# Altium schematic sheet key_count.SchDoc
size A4
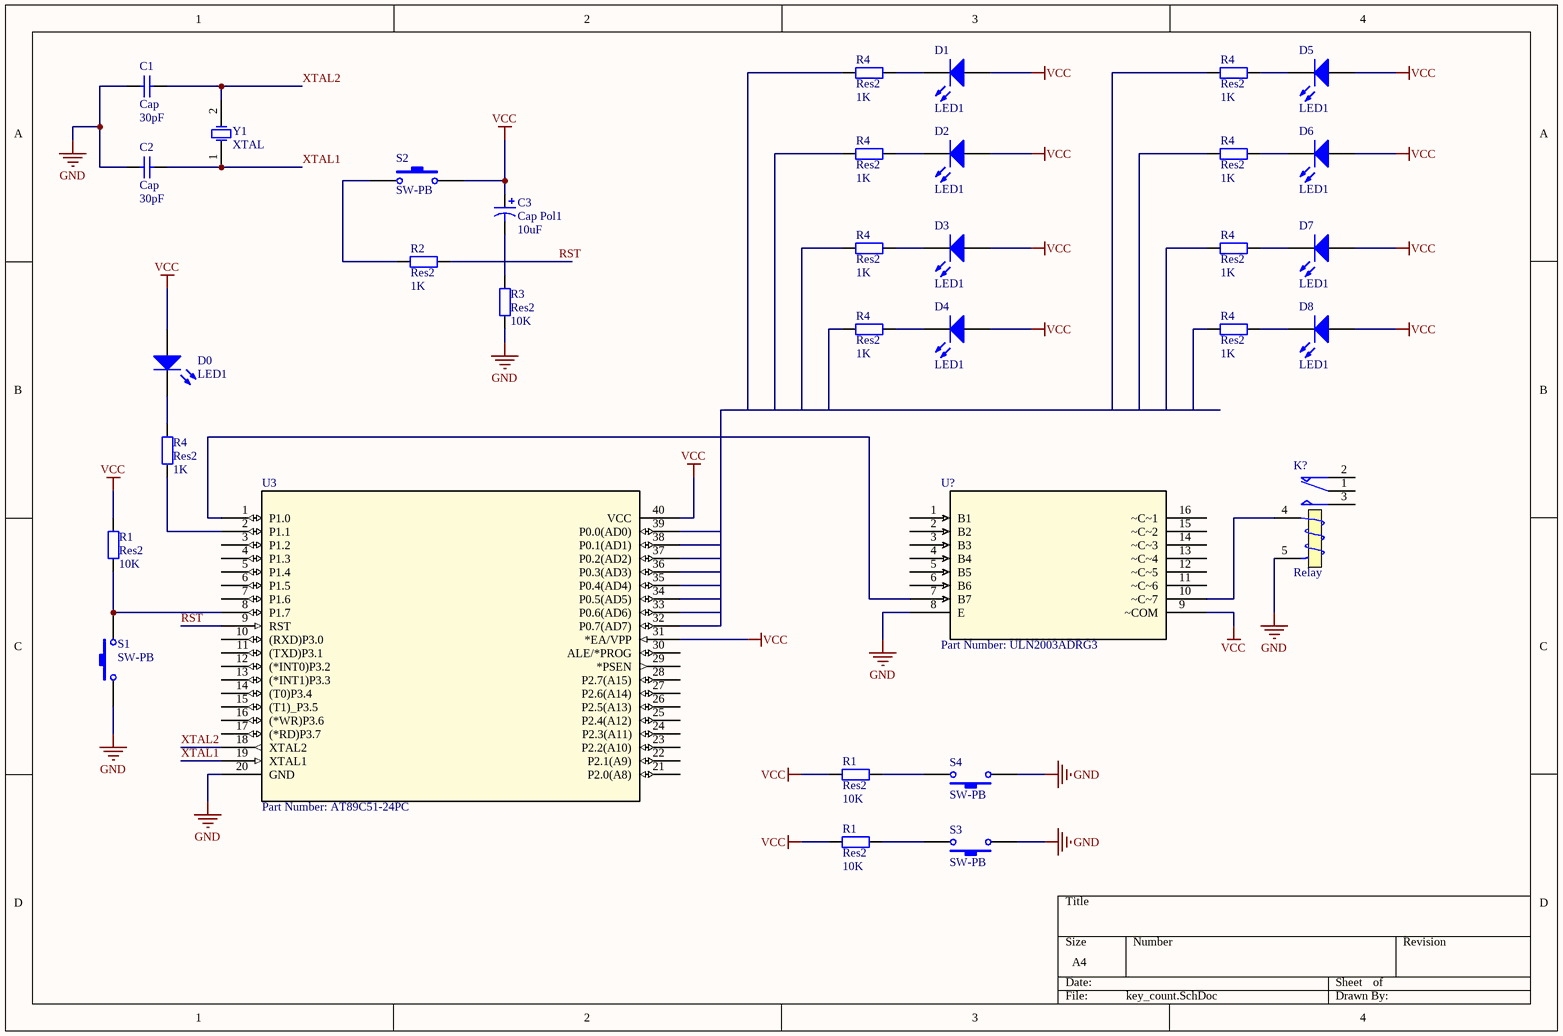
[diagram p0: key_count.SchDoc]

## Parts
(Parts that share a designator on the sheet are numbered #1, #2 ... from top to bottom, then left to right.)
C1  Cap  value 30pF  [RAD-0.3]
C2  Cap  value 30pF  [RAD-0.3]
C3  Cap Pol1  value 10uF  [RB7.6-15]
D0  LED1  [LED-1]
D1  LED1  [LED-1]
D2  LED1  [LED-1]
D3  LED1  [LED-1]
D4  LED1  [LED-1]
D5  LED1  [LED-1]
D6  LED1  [LED-1]
D7  LED1  [LED-1]
D8  LED1  [LED-1]
K?  Relay  [MODULE5B]
R1#1  Res2  value 10K  [AXIAL-0.4]
R1#2  Res2  value 10K  [AXIAL-0.4]
R1#3  Res2  value 10K  [AXIAL-0.4]
R2  Res2  value 1K  [AXIAL-0.4]
R3  Res2  value 10K  [AXIAL-0.4]
R4#1  Res2  value 1K  [AXIAL-0.4]
R4#2  Res2  value 1K  [AXIAL-0.4]
R4#3  Res2  value 1K  [AXIAL-0.4]
R4#4  Res2  value 1K  [AXIAL-0.4]
R4#5  Res2  value 1K  [AXIAL-0.4]
R4#6  Res2  value 1K  [AXIAL-0.4]
R4#7  Res2  value 1K  [AXIAL-0.4]
R4#8  Res2  value 1K  [AXIAL-0.4]
R4#9  Res2  value 1K  [AXIAL-0.4]
S1  SW-PB  [SPST-2]
S2  SW-PB  [SPST-2]
S3  SW-PB  [SPST-2]
S4  SW-PB  [SPST-2]
U3  Part Number: AT89C51-24PC  [40P6]
U?  Part Number: ULN2003ADRG3  [D16]
Y1  XTAL  [R38]

## Nets
GND: C1.1 C2.1 K?.5(T2) R3.1 S1.1 S3.1 S4.1 U3.20(GND) U?.8(E)
VCC: C3.1 D0.1(A) D1.1(A) D2.1(A) D3.1(A) D4.1(A) D5.1(A) D6.1(A) D7.1(A) D8.1(A) R1#1.2 R1#2.2 R1#3.2 S2.2 U3.31(*EA/VPP) U3.40(VCC) U?.9(~COM)
RST: R2.2 U3.9(RST)
XTAL1: C2.2 U3.19(XTAL1) Y1.1(OSC1)
XTAL2: C1.2 U3.18(XTAL2) Y1.2(OSC2)
NetC3_2: C3.2 R3.2
NetD0_2: D0.2(K) R4#9.2
NetD1_2: D1.2(K) R4#1.2
NetD2_2: D2.2(K) R4#3.2
NetD3_2: D3.2(K) R4#5.2
NetD4_2: D4.2(K) R4#7.2
NetD5_2: D5.2(K) R4#2.2
NetD6_2: D6.2(K) R4#4.2
NetD7_2: D7.2(K) R4#6.2
NetD8_2: D8.2(K) R4#8.2
NetK?_4: K?.4(T1) U?.10(~C~7)
NetR1#1_1: R1#1.1 S1.2 U3.8(P1.7)
NetR1#2_1: R1#2.1 S4.2
NetR1#3_1: R1#3.1 S3.2
NetR2_1: R2.1 S2.1
NetR4#9_1: R4#9.1 U3.2(P1.1)
NetU3_1: U3.1(P1.0) U?.7(B7)

Not connected (* = marked no-connect by the designer): K? 1(COM) 2(NC) 3(NO); R4#1 1; R4#2 1; R4#3 1; R4#4 1; R4#5 1; R4#6 1; R4#7 1; R4#8 1; U3 3(P1.2) 4(P1.3) 5(P1.4) 6(P1.5) 7(P1.6) 10((RXD)P3.0) 11((TXD)P3.1) 12((*INT0)P3.2) 13((*INT1)P3.3) 14((T0)P3.4) 15((T1)_P3.5) 16((*WR)P3.6) 17((*RD)P3.7) 21(P2.0(A8)) 22(P2.1(A9)) 23(P2.2(A10)) 24(P2.3(A11)) 25(P2.4(A12)) 26(P2.5(A13)) 27(P2.6(A14)) 28(P2.7(A15)) 29(*PSEN) 30(ALE/*PROG) 32(P0.7(AD7)) 33(P0.6(AD6)) 34(P0.5(AD5)) 35(P0.4(AD4)) 36(P0.3(AD3)) 37(P0.2(AD2)) 38(P0.1(AD1)) 39(P0.0(AD0)); U? 1(B1) 2(B2) 3(B3) 4(B4) 5(B5) 6(B6) 11(~C~6) 12(~C~5) 13(~C~4) 14(~C~3) 15(~C~2) 16(~C~1)

## Library data of the parts
C1 C2 = Cap: Capacitor; Published: 8-Jun-2000; LatestRevisionDate: 17-Jul-2002; LatestRevisionNote: Re-released for DXP Platform.; PackageReference: RAD-0.3; Publisher: Altium Limited; PackageDescription: Radial Cap, Thru-Hole; 2 Leads; 0.3 in Pin Spacing
C3 = Cap Pol1: Polarized Capacitor (Radial); Published: 8-Jun-2000; LatestRevisionDate: 17-Jul-2002; LatestRevisionNote: Re-released for DXP Platform.; PackageReference: RB7.6-15; Publisher: Altium Limited; PackageDescription: Polarized Capacitor (Radial); 2 Leads
D0-D8 = LED1: Typical RED GaAs LED; Published: 8-Jun-2000; LatestRevisionDate: 08-Jul-2005; LatestRevisionNote: Mech Layer 1 removed.; PackageReference: LED-1; Publisher: Altium Limited; PackageDescription: LED; 2 Leads
K? = Relay: SPDT Relay; Published: 8-Jun-2000; LatestRevisionDate: 17-Jul-2002; LatestRevisionNote: Re-released for DXP Platform.; PackageReference: MODULE5B; Publisher: Altium Limited
R1#1-R1#3 R2 R3 R4#1-R4#9 = Res2: Resistor; Published: 8-Jun-2000; LatestRevisionDate: 17-Jul-2002; LatestRevisionNote: Re-released for DXP Platform.; PackageReference: AXIAL-0.4; Publisher: Altium Limited; PackageDescription: Axial Device, Thru-Hole; 2 Leads; 0.4 in Pin Spacing
S1-S4 = SW-PB: Switch; Published: 24-Mar-1999; LatestRevisionDate: 17-Jul-2002; LatestRevisionNote: Re-released for DXP Platform.; PackageReference: SPST-2; Publisher: Altium Limited; PackageDescription: Switch; 2 Leads
U3 = AT89C51-24PC: No Description Available; VENDOR: Atmel; Built_By: EMA_UL_Team; MANUFACTURER_PART_NUMBER: AT89C51-24PC; Copyright: Copyright (C) 2018 Accelerated Designs. All rights reserved; RefDes: RefDes; Type: DEV; Value: Value
U? = ULN2003ADRG3: No Description Available; Vendor: Texas Instruments; Built_By: EMA_UL_Team; Manufacturer_Part_Number: ULN2003ADRG3; Copyright: Copyright (C) 2018 Accelerated Designs. All rights reserved; RefDes: RefDes; Type: DEV; Value: Value
Y1 = XTAL: Crystal Oscillator; Published: 8-Jun-2000; LatestRevisionDate: 17-Jul-2002; LatestRevisionNote: Re-released for DXP Platform.; PackageReference: R38; Publisher: Altium Limited; PackageDescription: Crystal, Thru-Hole; 2 Leads; Body 3.1 x 8.2 mm (Dia.xH)